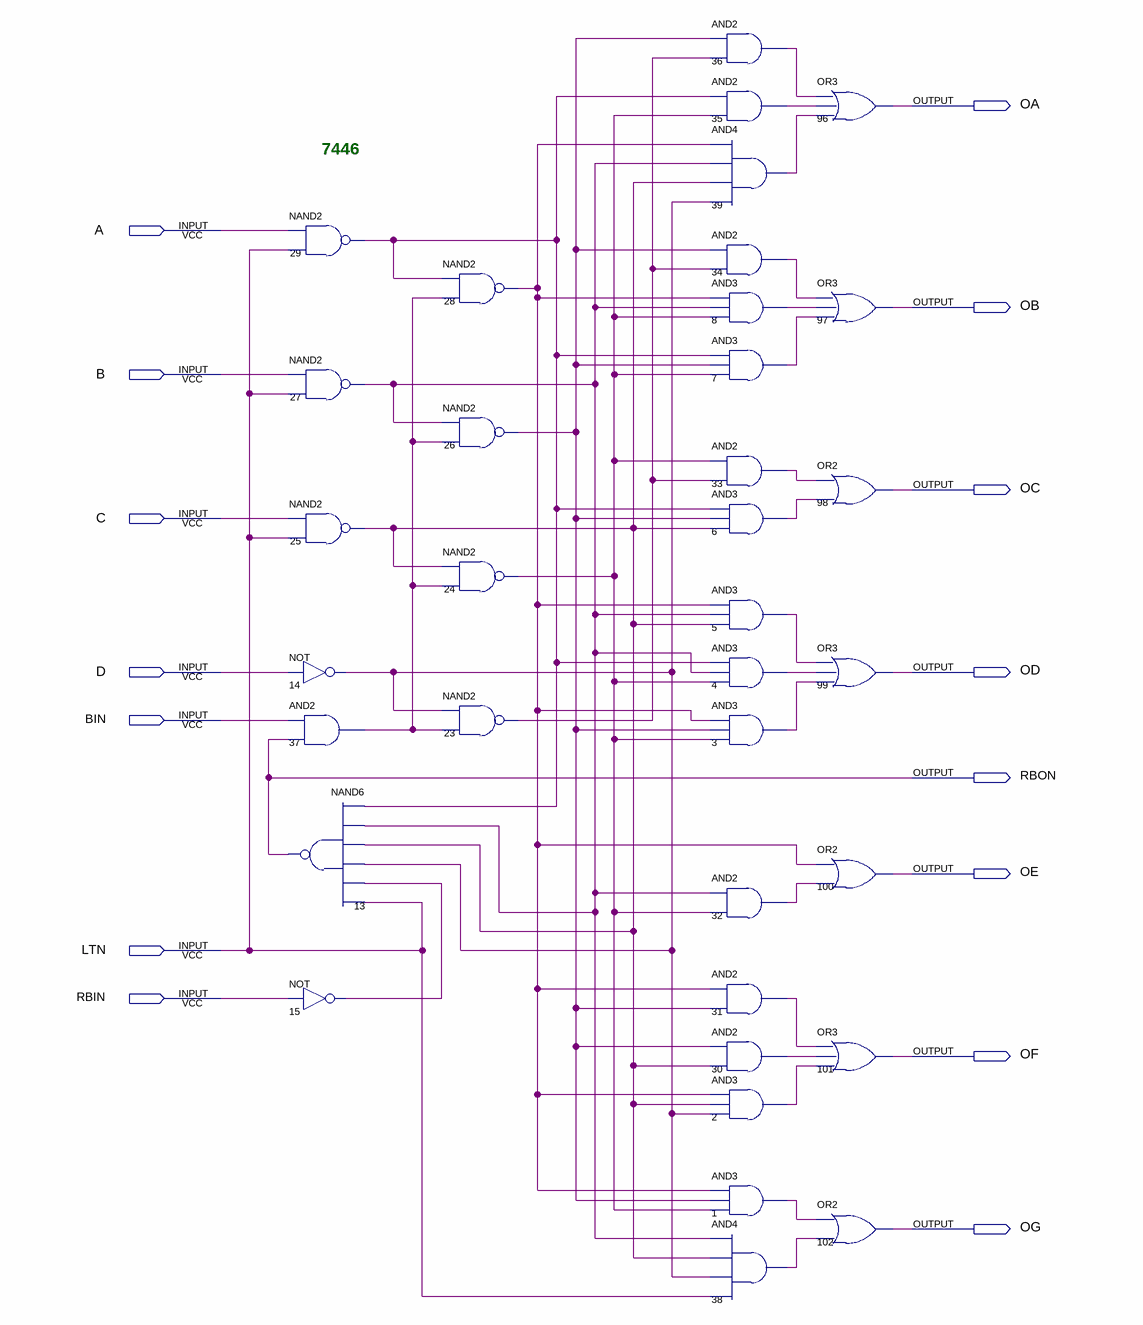
[diagram p0: schematic sheet]
// Quartus schematic 7446.bdf as structural Verilog: 35 symbols, 15 pins
module \7446  (
  input  A,
  input  B,
  input  C,
  input  D,
  input  BIN,
  input  LTN,
  input  RBIN,
  output OA,
  output OB,
  output OC,
  output OD,
  output RBON,
  output OE,
  output OF,
  output OG
);

  wire n1_out, n2_out, n3_out, n4_out, n5_out, n6_out, n7_out, n8_out, n14_out, n15_out, n23_out, n24_out,
       n25_out, n26_out, n27_out, n28_out, n29_out, n30_out, n31_out, n32_out, n33_out, n34_out, n35_out,
       n36_out, n37_out, n38_out, n39_out;

  nand u_29 (n29_out, A, LTN);
  nand u_27 (n27_out, B, LTN);
  nand u_25 (n25_out, C, LTN);
  not u_14 (n14_out, D);
  and u_37 (n37_out, BIN, RBON);
  nand u_13 (RBON, n29_out, n27_out, n25_out, n14_out, n15_out, LTN);
  not u_15 (n15_out, RBIN);
  nand u_28 (n28_out, n29_out, n37_out);
  nand u_26 (n26_out, n27_out, n37_out);
  nand u_24 (n24_out, n25_out, n37_out);
  nand u_23 (n23_out, n14_out, n37_out);
  and u_36 (n36_out, n26_out, n23_out);
  and u_35 (n35_out, n29_out, n24_out);
  and u_39 (n39_out, n28_out, n27_out, n25_out, n14_out);
  and u_34 (n34_out, n26_out, n23_out);
  and u_8 (n8_out, n28_out, n27_out, n24_out);
  and u_7 (n7_out, n29_out, n26_out, n24_out);
  and u_33 (n33_out, n24_out, n23_out);
  and u_6 (n6_out, n29_out, n26_out, n25_out);
  and u_5 (n5_out, n28_out, n27_out, n25_out);
  and u_4 (n4_out, n29_out, n27_out, n24_out);
  and u_3 (n3_out, n28_out, n26_out, n24_out);
  and u_32 (n32_out, n27_out, n24_out);
  and u_31 (n31_out, n28_out, n26_out);
  and u_30 (n30_out, n26_out, n25_out);
  and u_2 (n2_out, n28_out, n25_out, n14_out);
  and u_1 (n1_out, n28_out, n26_out, n24_out);
  and u_38 (n38_out, n27_out, n25_out, n14_out, LTN);
  or u_96 (OA, n36_out, n35_out, n39_out);
  or u_97 (OB, n34_out, n8_out, n7_out);
  or u_98 (OC, n33_out, n6_out);
  or u_99 (OD, n5_out, n4_out, n3_out);
  or u_100 (OE, n28_out, n32_out);
  or u_101 (OF, n31_out, n30_out, n2_out);
  or u_102 (OG, n1_out, n38_out);

  // Notes on the sheet:
  //   7446
endmodule
